# EAGLE design gauge_final (EAGLE 9.6.2)
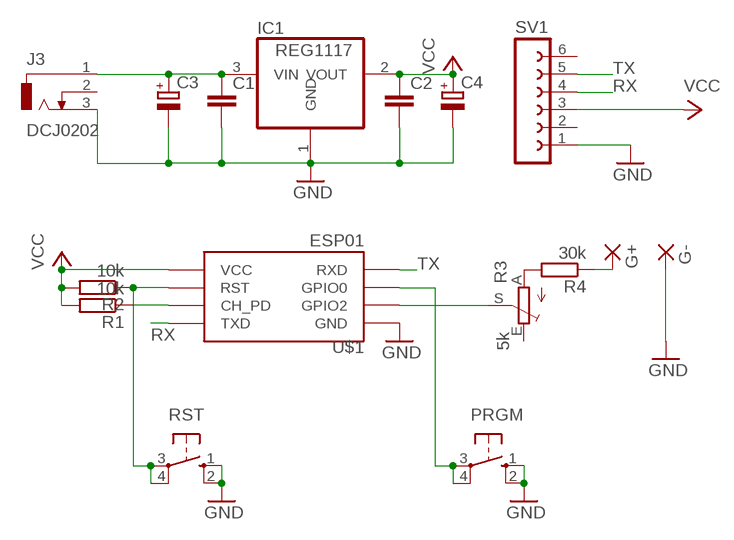
[diagram p0: schematic, sheet 1]

## Parts
C1  C-EUC0805  [C0805]
C2  C-EUC0805  [C0805]
C3  CPOL-EUSMCE  [SMC_E]
C4  CPOL-EUSMCE  [SMC_E]
G+  3,81/1,4  [3,81/1,4]
G-  3,81/1,4  [3,81/1,4]
IC1  REG1117  [SOT223]
J3  DCJ0202  [DCJ0202]
PRGM  10-XX  [B3F-10XX]
R1  10k  R-EU_R0805  [R0805]
R2  10k  R-EU_R0805  [R0805]
R3  5k  TRIM_EU-B90P  [SP19L]
R4  30k  R-EU_R0805  [R0805]
RST  10-XX  [B3F-10XX]
SV1  FE06-1  [FE06]
U$1  ESP01  [ESP01]

## Nets
GND: C1.2 C2.2 C3.- C4.- G-.1(P) IC1.1(GND) J3.3 PRGM.1(S) PRGM.2(S1) RST.1(S) RST.2(S1) SV1.1 U$1.GND
N$1: R2.1 RST.3(P) RST.4(P1) U$1.RST
N$2: R1.1 U$1.CH_PD
N$3: G+.1(P) R4.1
N$4: PRGM.3(P) PRGM.4(P1) U$1.GPIO0
N$5: R3.S U$1.GPIO2
N$6: C1.1 C3.+ IC1.3(VIN) J3.1
N$7: R3.A R4.2
RX: SV1.4 U$1.TX(TXD)
TX: SV1.5 U$1.RX(RXD)
VCC: C2.1 C4.+ IC1.2(VOUT) R1.2 R2.2 SV1.3 U$1.VCC
Unconnected: J3.2 R3.E SV1.2 SV1.6

## Library data of the parts
C1 C2 = rcl:C-EU: CAPACITOR, European symbol; SPICEPREFIX: C
C3 C4 = rcl:CPOL-EU: POLARIZED CAPACITOR, European symbol; SPICEPREFIX: C
G+ G- = wirepad:3,81/1,4: THROUGH-HOLE PAD
IC1 = burr-brown:REG1117: 800mA and 1A Low Dropout (LDO) Positive Regulator 1.8V, 2.5V, 2.85V, 3.3V, 5V, and Adj; MPN: REG1117; OC_FARNELL: 1097566; OC_NEWARK: 14P6981
J3 = con-jack-igi:DCJ0202: DC POWER JACK Source: DCJ0202.pdf; OC_FARNELL: unknown; OC_NEWARK: unknown
PRGM RST = switch-omron:10-XX: OMRON SWITCH; MPN: B3F-1000; OC_FARNELL: 176432; OC_NEWARK: 36M3542
R1 R2 R4 = rcl:R-EU_: RESISTOR, European symbol; SPICEPREFIX: R
R3 = pot:TRIM_EU-: POTENTIOMETER
SV1 = con-lsta:FE06-1: FEMALE HEADER; OC_FARNELL: unknown; OC_NEWARK: unknown
U$1 = esp8266modules:ESP01: ESP8266 Wifi module 01

## Board
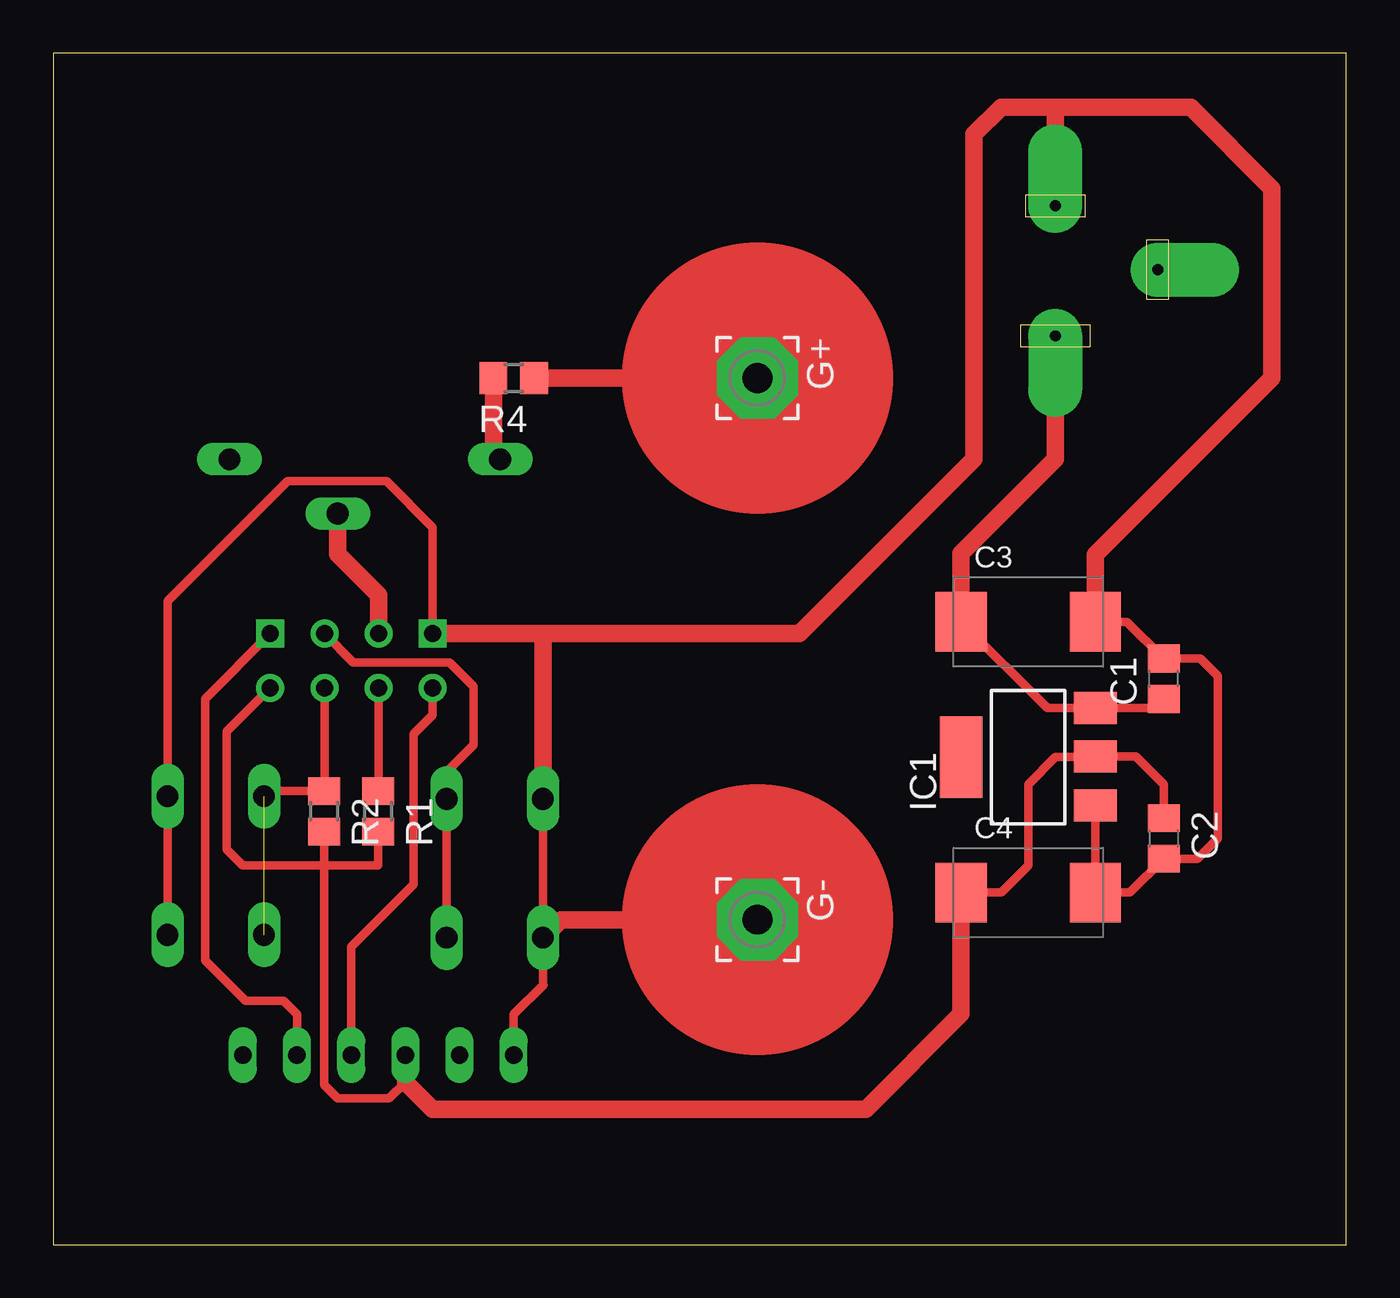
[diagram p1: board, top side]
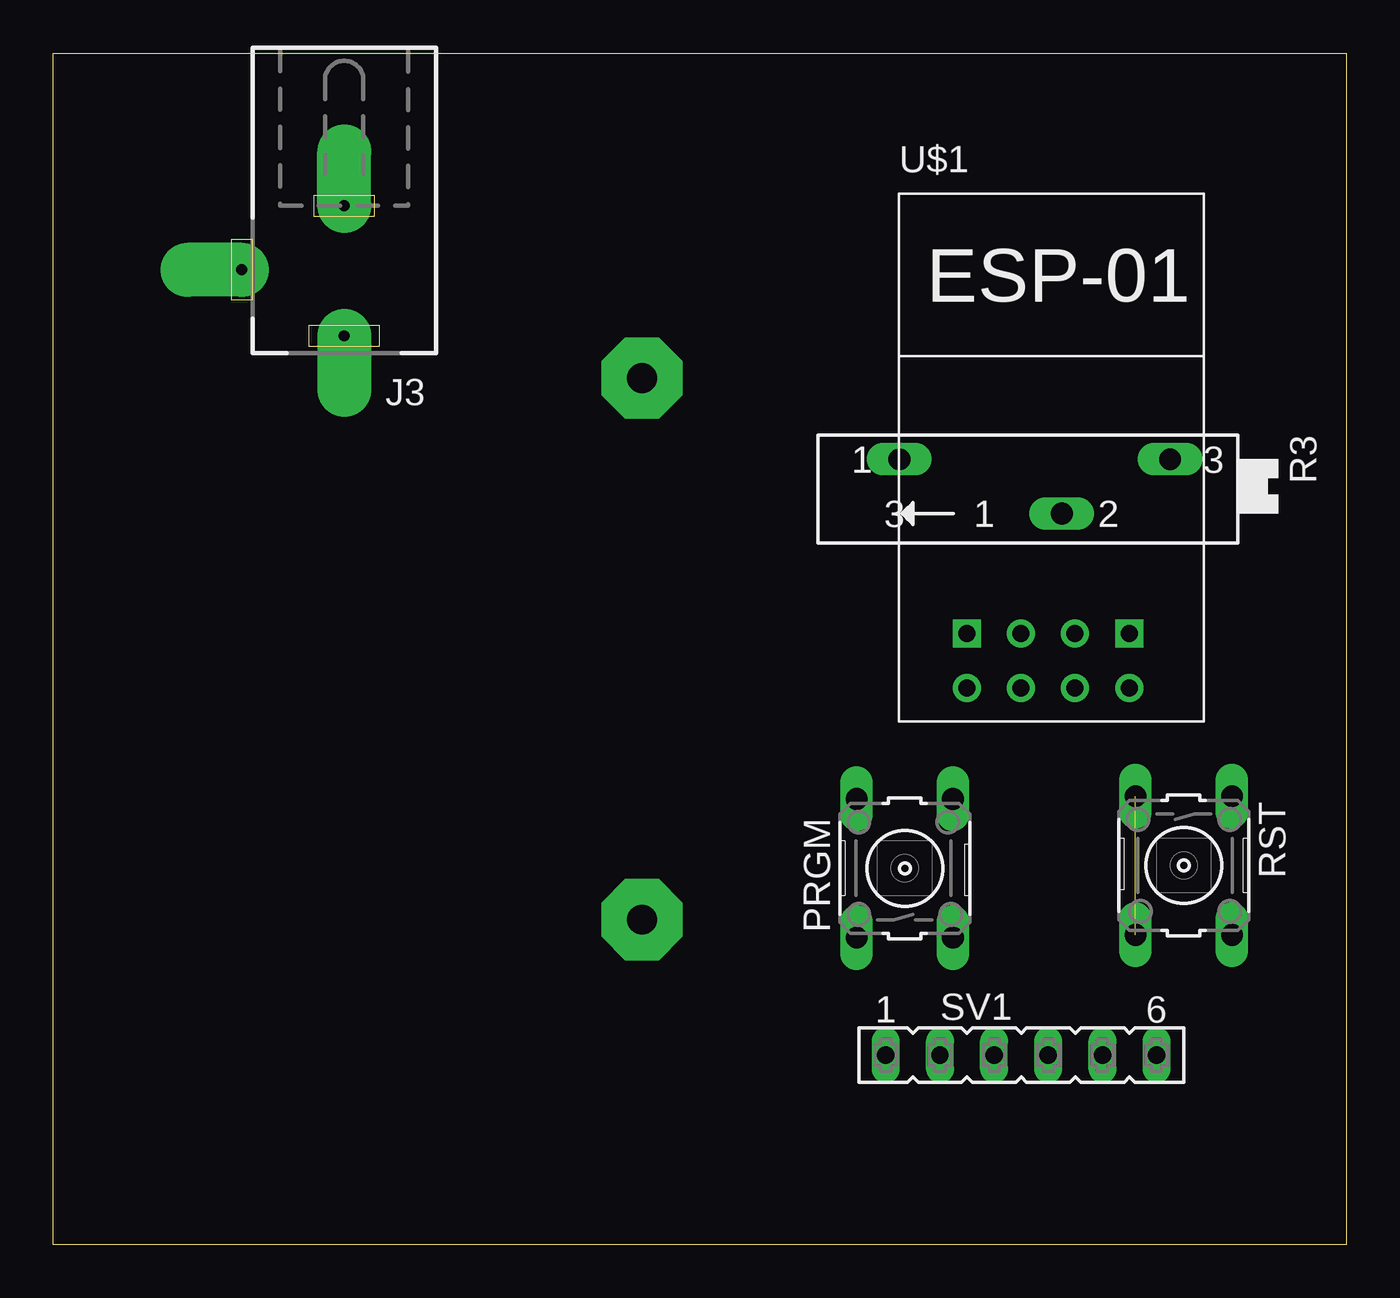
[diagram p2: board, bottom side, seen from below]

Size 60.63 x 55.87 mm. Coordinates in mm from the lower left corner, seen from the top.
Outline: 0,0 60.63,0 60.63,55.87 0,55.87 0,0
Copper layers (1*16): Top 0.035mm / dielectric 1.5mm / Bottom 0.035mm
Design rules "default": minimum track width 6mil, minimum drill 0.35mm, track to track 6mil, track to pad 6mil, pad to pad 6mil, via to via 6mil, smd to smd 6mil, copper to edge 40mil, drill to drill 6mil, minimum pad ring 10mil, minimum via ring 8mil, stop-mask expansion 4mil, vias tented up to drill 0mil, thermal gap 10mil

### Footprints (pad centres in the part's own frame; a part is rotated, then mirrored left to right if it is on the bottom)
C0805 = smd 1.3 x 1.5: 1 -0.95,0; 2 0.95,0
SMC_E = smd 2.4 x 2.8: + -3.15,0; - 3.15,0
3,81/1,4 = drill 1.397 pad 3.81 octagon: 1 0,0
SOT223 = smd 1.499 x 2.007: 1 -2.261,-3.15; 2 0.025,-3.15; 3 2.311,-3.15 | smd 3.81 x 2.007: 4 0,3.15
DCJ0202 = drill 0.508 pad 2.54 offset: 1 0,3.1; 2 4.8,0; 3 0,-3
B3F-10XX = drill 1.016 long: 1 -3.251,2.261; 2 3.251,2.261; 3 -3.251,-2.261; 4 3.251,-2.261
R0805 = smd 1.3 x 1.5: 1 -0.95,0; 2 0.95,0
SP19L = drill 1.016 long: A 5.715,-1.27; E -6.985,-1.27; S -1.905,1.27
FE06 = drill 0.813 long: 1 -6.35,0; 2 -3.81,0; 3 -1.27,0; 4 1.27,0; 5 3.81,0; 6 6.35,0
ESP01 = drill 0.8: CH_PD -1.285,-8.178; GPIO0 1.255,-5.638; GPIO2 -1.285,-5.638; RST 1.255,-8.178; TX -3.825,-8.178; VCC 3.795,-8.178 | drill 0.8 square: GND -3.825,-5.638; RX 3.795,-5.638

### Placement (x,y rotation side)
C1  52.07,26.54 90 top
C2  52.07,19.05 270 top
C3  45.72,29.21 0 top
C4  45.72,16.51 0 top
G+  33.02,40.64 270 top
G-  33.02,15.24 270 top
IC1  45.72,22.86 90 top
J3  46.99,45.72 180 bottom
PRGM  20.7,17.65 90 bottom
R1  15.24,20.32 270 top
R2  12.7,20.32 270 top
R3  15.24,35.56 180 bottom
R4  21.59,40.64 180 top
RST  7.62,17.78 270 bottom
SV1  15.24,8.89 0 bottom
U$1  13.97,34.29 0 bottom

### Tracks (layer width: path | path; a pad name or v marks a point on that pad's centre or on a via)
GND
  Top 0.406: C4.- 49.43,16.51 | C3.- 50.35,29.21 C1.2 53.79,27.49 54.61,26.67 54.61,19.05 53.66,18.1 C2.2 50.48,16.51 C4.- | C4.- IC1.1 | IC1.1 | U$1.GND 17.8,33.64 15.62,35.81 11,35.81 5.36,30.18 RST.1 RST.2 | PRGM.2 PRGM.1 22.96,12.22 22.99,12.19 21.59,10.79 SV1.1
  Top 0.813: U$1.GND 22.86,28.65 | 22.86,28.65 35,28.65 43.18,36.83 43.18,52.07 44.45,53.34 46.99,53.34 | PRGM.2 22.96,28.55 22.86,28.65 | PRGM.1 23.8,15.24 G-.1 | C3.- 48.87,32.36 57.15,40.64 57.15,49.53 53.34,53.34 46.99,53.34 | J3.3 46.99,53.34
N$1  (1 unrouted)
  Top 0.406: U$1.RST 12.71,21.29 R2.1 10.12,21.27 RST.3
N$2
  Top 0.406: 15.22,21.29 R1.1 15.26,21.29 U$1.CH_PD
N$3
  Top 0.813: R4.1 G+.1
N$4
  Top 0.406: U$1.GPIO0 14.06,27.3 18.59,27.3 19.71,26.19 19.71,23.44 18.44,22.17 PRGM.4 PRGM.3
N$5
  Top 0.813: R3.S 13.34,32.38 15.26,30.46 U$1.GPIO2
N$6
  Top 0.406: 49.1,25.4 IC1.3 | C1.1 51.65,25.17 IC1.3 | IC1.3 46.61,25.17 C3.+
  Top 0.813: C3.+ 42.57,32.41 46.99,36.83 J3.1
N$7
  Top 0.813: R3.A 20.64,37.15 R4.2
RX
  Top 0.406: U$1.TX 17.8,24.84 16.89,23.94 16.89,16.89 13.97,13.97 SV1.4
TX
  Top 0.406: U$1.RX 7.11,25.59 7.11,13.34 9.02,11.43 10.79,11.43 11.43,10.79 SV1.5
VCC
  Top 0.406: C2.1 52.07,21.59 50.77,22.89 IC1.2 48.84,22.86 46.99,22.86 45.72,21.59 45.72,17.78 44.45,16.51 C4.+ | R1.2 15.24,17.78 12.7,17.78 | U$1.VCC 8.13,24.07 8.13,18.54 8.89,17.78 12.7,17.78 | R2.2 12.7,17.78 | SV1.3 16.51,7.62 15.75,6.86 13.34,6.86 12.7,7.49 12.7,17.78
  Top 0.813: C4.+ 42.57,10.82 38.1,6.35 17.78,6.35 16.51,7.62
(copper drawn outside any net)
  shapes: Top circle x2